# Altium schematic sheet PS1_USBC_Input_and_Buck.SchDoc
size A4; SheetNumber: 4; SheetTotal: 20
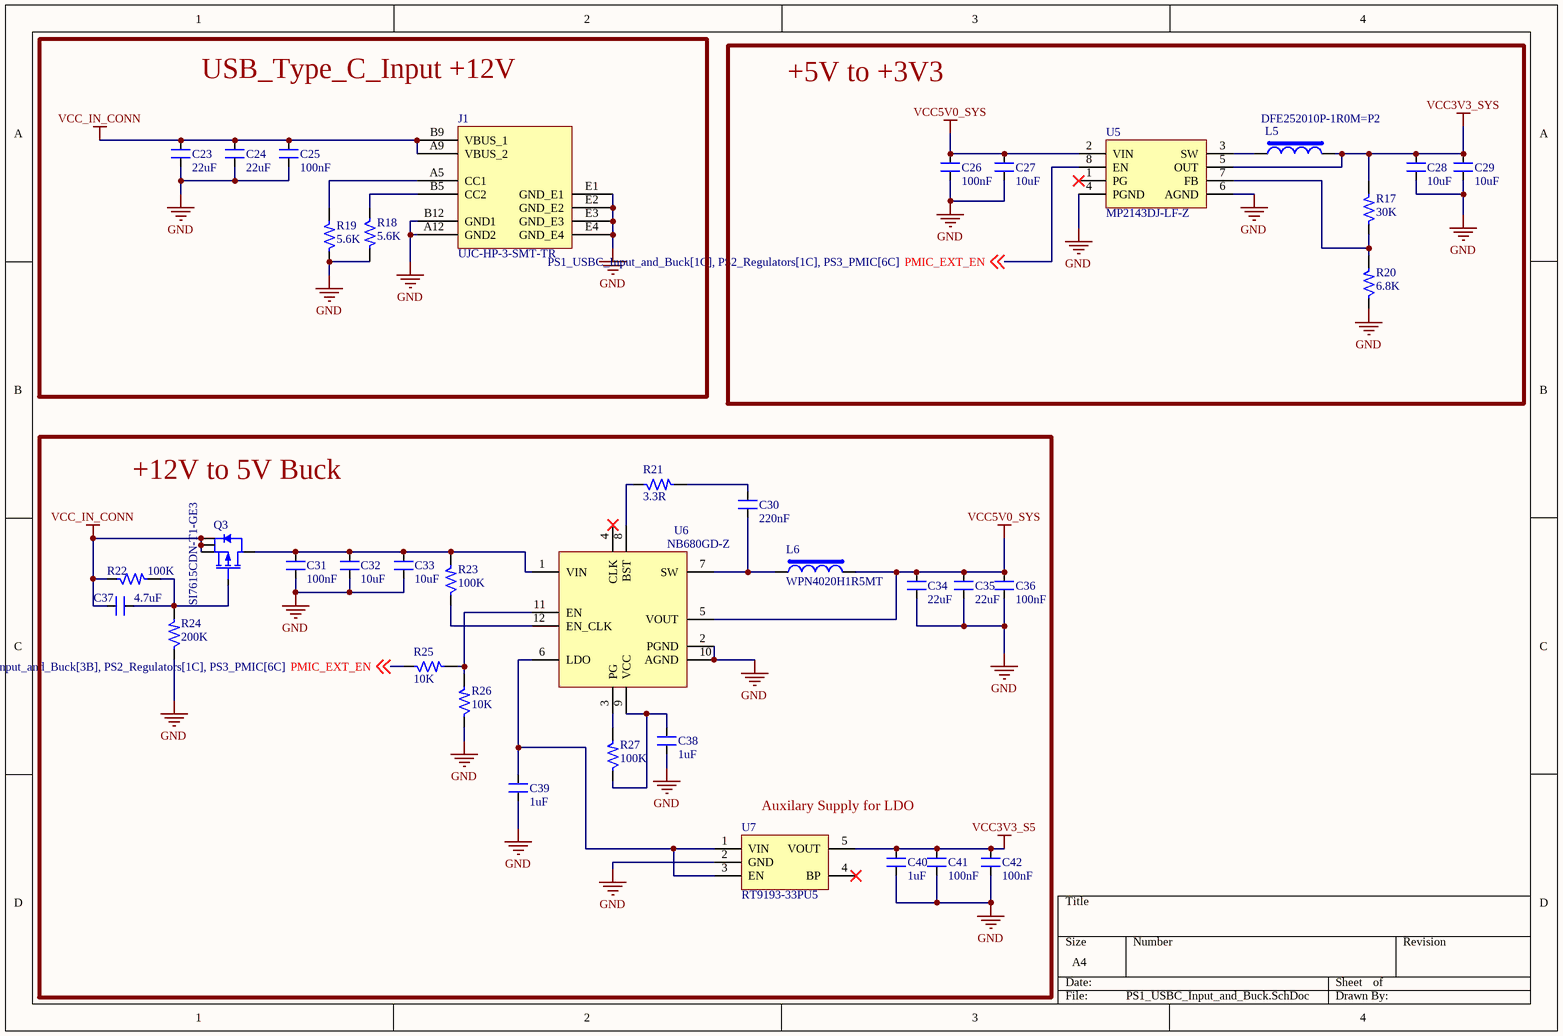
[diagram p0: PS1_USBC_Input_and_Buck.SchDoc]

## Parts
C23  22uF  [CAP_0603]
C24  22uF  [CAP_0603]
C25  100nF  [CAP_0402]
C26  100nF  [CAP_0402]
C27  10uF  [CAP_0402]
C28  10uF  [CAP_0402]
C29  10uF  [CAP_0402]
C30  220nF  [CAP_0402]
C31  100nF  [CAP_0402]
C32  10uF  [CAP_0402]
C33  10uF  [CAP_0402]
C34  22uF  [CAP_0603]
C35  22uF  [CAP_0603]
C36  100nF  [CAP_0402]
C37  4.7uF  [CAP_0402]
C38  1uF  [CAP_0402]
C39  1uF  [CAP_0402]
C40  1uF  [CAP_0402]
C41  100nF  [CAP_0402]
C42  100nF  [CAP_0402]
J1  UJC-HP-3-SMT-TR  [CON6_48.4_UJC-HP-3-SMT-TR]
L5  DFE252010P-1R0M=P2  [IND_1008]
L6  WPN4020H1R5MT  [IND_1616]
Q3  SI7615CDN-T1-GE3  [PowerPAK_1212-8_SMD]
R17  30K  [RES_0402]
R18  5.6K  [RES_0402]
R19  5.6K  [RES_0402]
R20  6.8K  [RES_0402]
R21  3.3R  [RES_0402]
R22  100K  [RES_0402]
R23  100K  [RES_0402]
R24  200K  [RES_0402]
R25  10K  [RES_0402]
R26  10K  [RES_0402]
R27  100K  [RES_0402]
U5  MP2143DJ-LF-Z  [SOT23-8]
U6  NB680GD-Z  [QFN-12_19_118X118_SMD]
U7  RT9193-33PU5  [SC70-5]

## Blocks framed on the sheet
USB_Type_C_Input +12V: C23-C25 J1 R18 R19
+5V to +3V3: C26-C29 L5 R17 R20 U5
+12V to 5V Buck: C30-C42 L6 Q3 R21-R27 U6 U7

## Nets
GND: C23.1 C24.1 C25.1 C26.1 C27.1 C28.1 C29.1 C31.1 C32.1 C33.1 C34.1 C35.1 C36.1 C38.1 C39.1 C40.1 C41.1 C42.1 J1.A12(GND2) J1.B12(GND1) J1.E1(GND_E1) J1.E2(GND_E2) J1.E3(GND_E3) J1.E4(GND_E4) R18.2 R19.1 R20.1 R24.1 R26.1 U5.4(PGND) U5.6(AGND) U6.2(PGND) U6.10(AGND) U7.2(GND)
VCC3V3_S5: C40.2 C41.2 C42.2 U7.5(VOUT)
VCC3V3_SYS: C28.2 C29.2 L5.2 R17.2 U5.5(OUT)
VCC5V0_SYS: C26.2 C27.2 C34.2 C35.2 C36.2 L6.2 U5.2(VIN) U6.5(VOUT)
VCC_IN_CONN: C23.2 C24.2 C25.2 C37.1 J1.A9(VBUS_2) J1.B9(VBUS_1) Q3.1(S) Q3.2(S) Q3.3(S) R22.1
PMIC_EXT_EN: R25.1 U5.8(EN) ; off-sheet PMIC_EXT_EN
NetC30_1: C30.1 L6.1 U6.7(SW)
NetC30_2: C30.2 R21.2
NetC31_2: C31.2 C32.2 C33.2 Q3.5(D) R23.2 U6.1(VIN)
NetC37_2: C37.2 Q3.4(G) R22.2 R24.2
NetC38_2: C38.2 R27.1 U6.9(VCC)
NetC39_2: C39.2 U6.6(LDO) U7.1(VIN) U7.3(EN)
NetJ1_A5: J1.A5(CC1) R19.2
NetJ1_B5: J1.B5(CC2) R18.1
NetL5_1: L5.1 U5.3(SW)
NetR17_1: R17.1 R20.2 U5.7(FB)
NetR21_1: R21.1 U6.8(BST)
NetR23_1: R23.1 U6.12(EN_CLK)
NetR25_2: R25.2 R26.2 U6.11(EN)
NetR27_2: R27.2 U6.3(PG)

Not connected (* = marked no-connect by the designer): U5 1(PG)*; U6 4(CLK)*; U7 4(BP)*

## Notes on the sheet
- Auxilary Supply for LDO

## Library data of the parts
C23 C24 C34 C35 = CAP_22uF-10V-20%-0603: 22µF ±20% 10V Ceramic Capacitor X5R 0603 (1608 Metric); Manufacturer: Murata Electronics; Manufacturer Part Number: GRM188R61A226ME15D; Case/Package: 0603; Supplier-1: Digikey
C25 C26 C31 C36 C41 C42 = CAP_100nF-25V-10%-0402: 0.1µF ±10% 25V Ceramic Capacitor X7R 0402 (1005 Metric); Manufacturer: Walsin Technology Corporation; Manufacturer Part Number: 0402B104K250CT; Case/Package: 0402; Supplier-1: Digikey
C27-C29 C32 C33 = CAP_10uF-10V-20%-0402: 10µF ±20% 10V Ceramic Capacitor X5R 0402 (1005 Metric); Manufacturer Part Number: CL05A106MP5NUNC; Manufacturer: Samsung Electro-Mechanics; Case/Package: 0402; Supplier-1: Digikey
C30 = CAP_220nF-10V-10%-0402: 0.22µF ±10% 10V Ceramic Capacitor X7R 0402 (1005 Metric); Manufacturer: Samsung Electro-Mechanics; Manufacturer Part Number: CL05B224KP5NNNC; Case/Package: 0402; Supplier-1: Digikey
C37 = CAP_4.7uF-10V-10%-0402: 4.7µF ±10% 10V Ceramic Capacitor X5R 0402 (1005 Metric); Manufacturer: Samsung Electro-Mechanics; Manufacturer Part Number: CL05A475KP5NRNC; Case/Package: 0402; Supplier-1: Digikey
C38-C40 = CAP_1uF-16V-10%-0402: 1µF ±10% 16V Ceramic Capacitor X5R 0402 (1005 Metric); Manufacturer: Knowles Novacap; Manufacturer Part Number: 0402BW105K160YT; Case/Package: 0402; Supplier-1: Digikey
J1 = CON-TYPEC_6X1-100-RA-TH: USB Connectors USB jack, C type, power only, 6 pin, horizonal, gold flash plating, surface mount, T&R; Manufacturer: CUI Devices; Manufacturer Part Number: UJC-HP-3-SMT-TR; Case/Package: TH; Supplier-1: Mouser
L5 = IND_1uH-3.8A-20%-1008: 1µH Shielded Wirewound Inductor 3.8A 54mOhm Max 1008 (2520 Metric); Manufacturer: Murata Electronics; Manufacturer Part Number: DFE252010P-1R0M=P2; Case/Package: 1008; Supplier-1: Digikey
L6 = IND_1.5uH-6A-20%-SMD: Wire Wound SMD Power Inductors – WPN Series / Operating Temp. : -40℃~+125℃ (Including self-heating); Manufacturer: Sunlord; Mnaufcaturer Part Number: WPN4020H1R5MT; Case/Package: SMD; Supplier-1: NA
Q3 = MOSFET-P_20V-35A-1212-8: P-Channel 20V 35A (Tc) 33W (Tc) Surface Mount PowerPAK® 1212-8; Manufacturer: Vishay Siliconix; Manufacturer Part Number: SI7615CDN-T1-GE3; Case/Package: PowerPAK® 1212-8; Supplier-1: Digikey
R17 = RES_30K-0.1W-1%-0402: 30 kOhms ±1% 0.1W, 1/10W Chip Resistor 0402 (1005 Metric) Automotive AEC-Q200, Moisture Resistant Thick Film; Manufacturer: KOA Speer Electronics, Inc.; Manufacturer Part Number: RK73H1ETTP3002F; Case/Package: 0402; Supplier-1: Digikey
R18 R19 = RES_5.6K-0.1W-1%-0402: 5.6 kOhms ±1% 0.1W, 1/10W Chip Resistor 0402 (1005 Metric) Automotive AEC-Q200, Moisture Resistant Thick Film; Manufacturer: KOA Speer Electronics, Inc.; Manufacturer Part Number: RK73H1ETTP5601F; Case/Package: 0402; Supplier-1: Digikey
R20 = RES_6.8K-0.1W-1%-0402: 6.8 kOhms ±1% 0.1W, 1/10W Chip Resistor 0402 (1005 Metric) Anti-Sulfur Thin Film; Manufacturer: Vishay Beyschlag/Draloric/BC Components; Manufacturer Part Number: MCS04020C6801FE000; Supplier-1: Digikey; Case/Package: 0402
R21 = RES_3.3R-0.1W-1%-0402: 3.3 Ohms ±1% 0.1W, 1/10W Chip Resistor 0402 (1005 Metric) Anti-Sulfur, Automotive AEC-Q200 Thick Film; Manufacturer: Panasonic Electronic Components; Manufacturer Part Number: ERJ-U02F3R30X; Case/Package: 0402; Supplier-1: Digikey
R22 R23 R27 = RES_100K-0.1W-1%-0402: 100 kOhms ±1% 0.1W, 1/10W Chip Resistor 0402 (1005 Metric) Anti-Sulfur Thin Film; Manufacturer: Vishay Beyschlag/Draloric/BC Components; Manufacturer Part Number: MCS04020C1003FE000; Case/Package: 0402; Supplier-1: Digikey
R24 = RES_200K-0.1W-1%-0402: 200 kOhms ±1% 0.1W, 1/10W Chip Resistor 0402 (1005 Metric) Automotive AEC-Q200 Thick Film; Manufacturer: Panasonic Electronic Components; Manufacturer Part number: ERJ-2RKF2003X; Case/Package: 0402; Supplier-1: Digikey
R25 R26 = RES_10K-0.1W-1%-0402: 10 kOhms ±1% 0.1W, 1/10W Chip Resistor 0402 (1005 Metric) Anti-Sulfur Thin Film; Manufacturer: Vishay Beyschlag/Draloric/BC Components; Manufacturer Part Number: MCS04020C1002FE000; Case/Package: 0402; Supplier-1: Digikey
U5 = REG_0.6~5V-5.5V-3A-TSOT-23-8: Switching Voltage Regulators 3A, 5.5V, 1.2MHz Sync Stp-Dwn Swtchr; Manufacturer: Monolithic Power Systems (MPS); Manufacturer Part Number: MP2143DJ-LF-Z; Case/Package: TSOT-23-8; Supplier-1: Mouser
U6 = REG_3.3V-26V-8A-QFN-12: Switching Voltage Regulators 26V Fixed 3.3 V-8A Sync Buck Converter; Manufacturer: Monolithic Power Systems (MPS); Manufacturer Part Number: NB680GD-Z; Case/Package: QFN-12; Supplier-1: Mouser
U7 = REG_3.3V-5.5V-300mA-SC-70-5: SC-70-5 Dropout Regulators(LDO) RoHS; Manufacturer: Richtek Tech; Manufacturer Part Number: RT9193-33PU5; Case/Package: SC-70-5; Supplier-1: LCSC